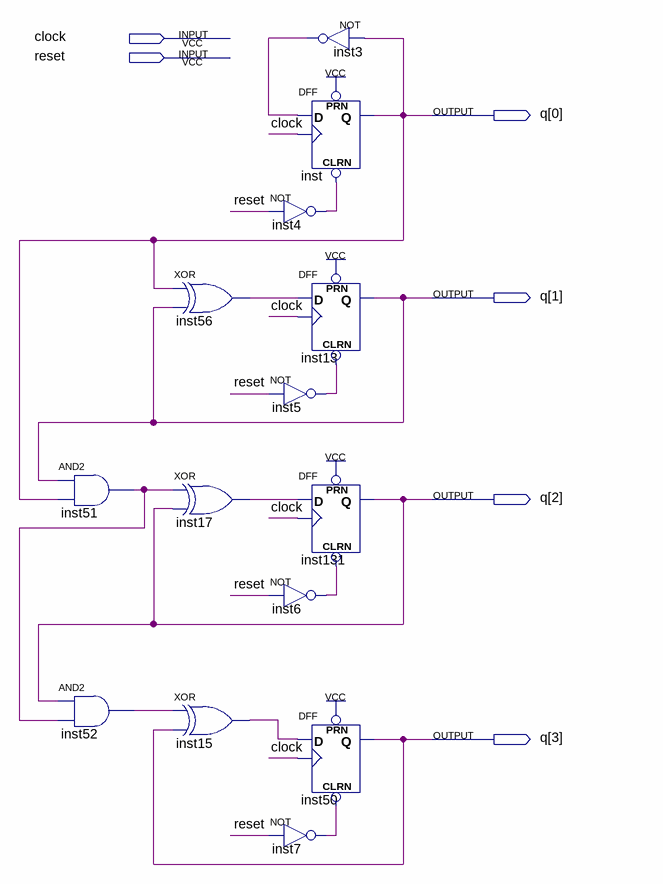
[diagram p0: schematic sheet]
// Quartus schematic upCounter4bits.bdf as structural Verilog: 14 symbols, 6 pins
module upCounter4bits (
  input  clock,
  input  reset,
  output [3:0] q
);

  wire inst3_out, inst4_out, inst5_out, inst6_out, inst7_out, inst15_out, inst17_out, inst51_out, inst52_out,
       inst56_out;

  and inst51 (inst51_out, q[1], q[0]);
  and inst52 (inst52_out, q[2], inst51_out);
  xor inst56 (inst56_out, q[0], q[1]);
  xor inst17 (inst17_out, inst51_out, q[2]);
  xor inst15 (inst15_out, inst52_out, q[3]);
  not inst4 (inst4_out, reset);
  not inst5 (inst5_out, reset);
  not inst6 (inst6_out, reset);
  not inst7 (inst7_out, reset);
  not inst3 (inst3_out, q[0]);
  DFF inst (.CLRN(inst4_out), .CLK(clock), .D(inst3_out), .PRN(1'b1), .Q(q[0]));
  DFF inst13 (.CLRN(inst5_out), .CLK(clock), .D(inst56_out), .PRN(1'b1), .Q(q[1]));
  DFF inst131 (.CLRN(inst6_out), .CLK(clock), .D(inst17_out), .PRN(1'b1), .Q(q[2]));
  DFF inst50 (.CLRN(inst7_out), .CLK(clock), .D(inst15_out), .PRN(1'b1), .Q(q[3]));
endmodule
